# Altium project Remote_Emergency_Stop.PrjPcb
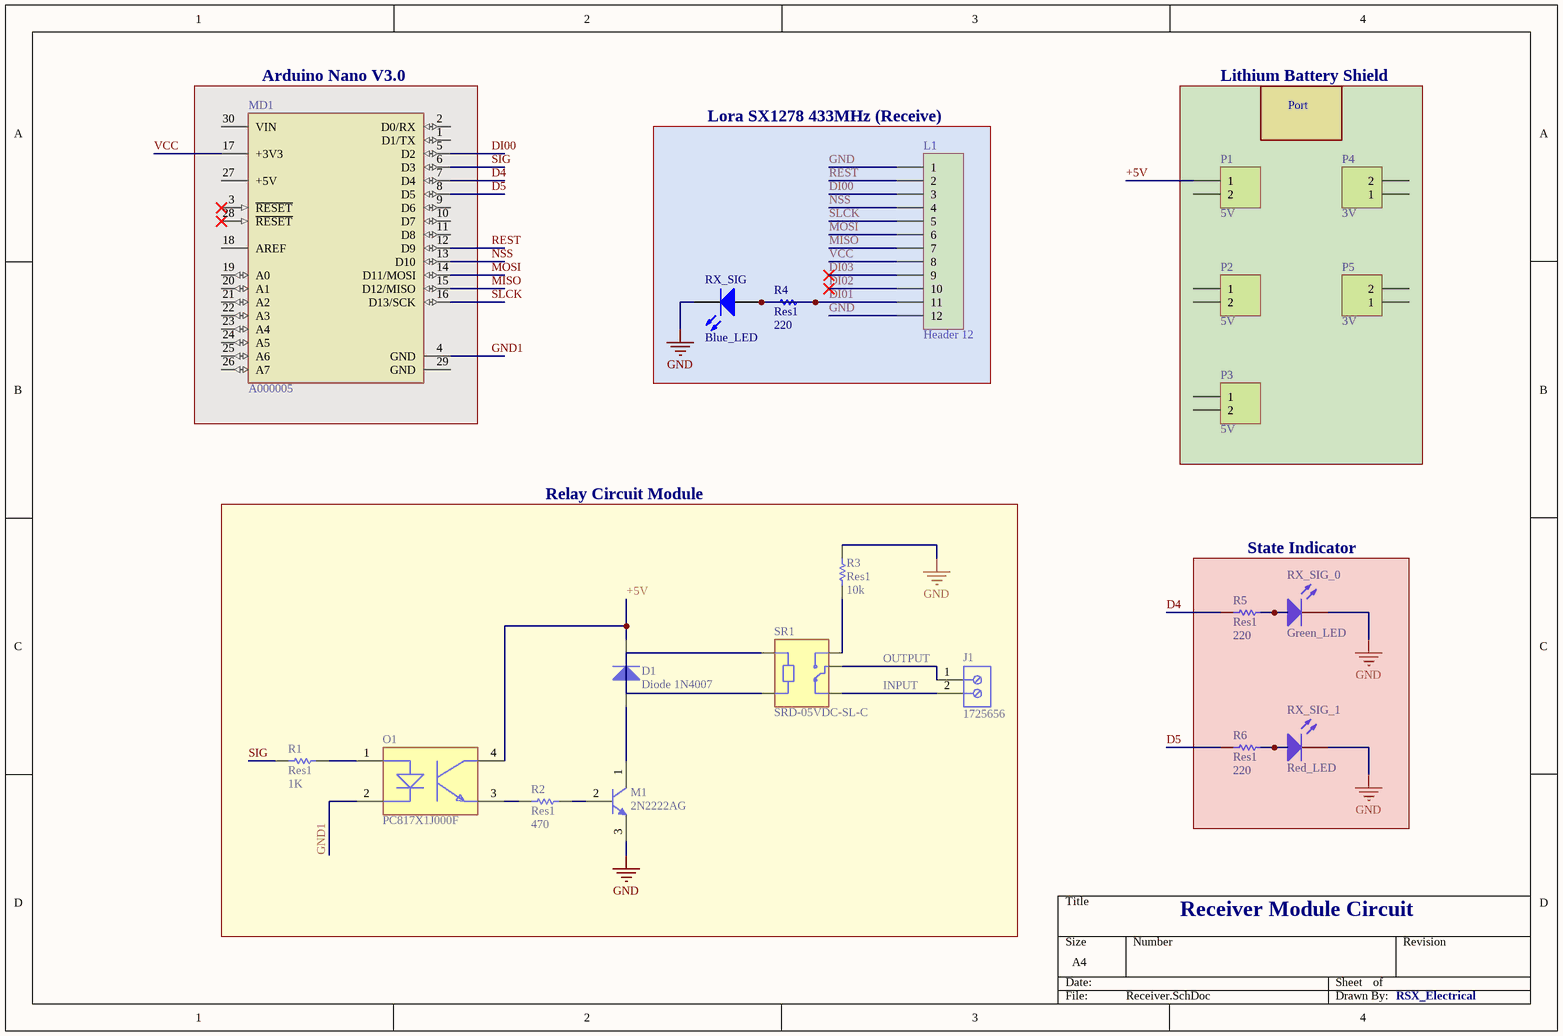
[diagram p0: Receiver.SchDoc]
2 sheets, 36 parts. Net scope: global (net labels, ports and power ports of the same name join across sheets).
Board file: Remote_E_Stop.PcbDoc
Sheets:
  Receiver.SchDoc
  Transmitter.SchDoc

## Sheet Receiver.SchDoc
size A4; SheetNumber: 1; SheetTotal: 1; SPICEModelCacheURACZJYY: <root> / <DocumentId>URACZJYY</DocumentId> / <CacheFrame Number="0"> / <Model Name="1n4007" Kind="MDL"> / <Text>*1N4007 MCE 8-16-95 / *1000V 1A Si GenPurpose Diode pkg:DIODE0.4 1,2 / .MODEL 1N4007 D(IS=2.55E-9 RS=0.042 N=1.75 TT=5.76E-6 CJO=1.85E-11 / + VJ=0.75 M=0.333 BV=1000 IBV=9.86E-5 )</Text> / </Model> / <Model Name="led0" Kind="MDL"> / <Text>*Typ INFRARED GaAs LED: Vf=1.2V Vr=5V If=40mA trr=3uS / *LED Pinout: 1=A, 2=K / .MODEL LED0 D (IS=93.5P RS=84M N=2.63 BV=5 IBV=10U / + CJO=2.97P VJ=.75 M=.333 TT=4.32U)</Text> / </Model> / </CacheFrame> / </root>

### Parts
D1  Diode 1N4007  [DO-41]
J1  1725656  [PHOE-1725656-2]
L1  Header 12  [HDR1X12]
M1  2N2222AG  [ONSC-TO-92-3-29-11]
MD1  A000005  [FP-A000005-MFG]
O1  PC817X1J000F  [FP-PC817X1J000F-MFG]
P1  5V  [HDR1X2]
P2  5V  [HDR1X2]
P3  5V  [HDR1X2]
P4  3V  [HDR1X2]
P5  3V  [HDR1X2]
R1  Res1  value 1K  [AXIAL-0.3]
R2  Res1  value 470  [AXIAL-0.3]
R3  Res1  value 10k  [AXIAL-0.3]
R4  Res1  value 220  [AXIAL-0.3]
R5  Res1  value 220  [AXIAL-0.3]
R6  Res1  value 220  [AXIAL-0.3]
RX_SIG  Blue_LED  [LED-0]
RX_SIG_0  Green_LED  [LED-0]
RX_SIG_1  Red_LED  [LED-0]
SR1  SRD-05VDC-SL-C  [RELAY_SRD-05VDC-SL-C]

### Blocks framed on the sheet
Arduino Nano V3.0: MD1
Lithium Battery Shield: P1-P5
Lora SX1278 433MHz (Receive): L1 R4 RX_SIG
Relay Circuit Module: D1 J1 M1 O1 R1-R3 SR1
State Indicator: R5 R6 RX_SIG_0 RX_SIG_1

### Nets
GND: L1.1 L1.12 M1.3(E) R3.2 RX_SIG.2(K) RX_SIG_0.2(K) RX_SIG_1.2(K)
+5V: D1.2(K) O1.4(C) P1.1
D4: MD1.7(D4) R5.2
D5: MD1.8(D5) R6.2
DI00: L1.3 MD1.5(D2)
DI01: L1.11 R4.1 R4.2 RX_SIG.1(A)
DI02: L1.10
DI03: L1.9
GND1: MD1.4(GND) O1.2(C)
MISO: L1.7 MD1.15(D12/MISO)
MOSI: L1.6 MD1.14(D11/MOSI)
NSS: L1.4 MD1.13(D10)
REST: L1.2 MD1.12(D9)
SIG: MD1.6(D3) R1.2
SLCK: L1.5 MD1.16(D13/SCK)
VCC: L1.8 MD1.17(+3V3)
NetD1_1: D1.1(A) M1.1(C)
NetJ1_1: J1.1 SR1.COM
NetJ1_2: J1.2 SR1.NC
NetM1_2: M1.2(B) R2.2
NetO1_1: O1.1(A) R1.1
NetO1_3: O1.3(E) R2.1
NetR3_1: R3.1 SR1.NO
NetR5_1: R5.1 RX_SIG_0.1(A)
NetR6_1: R6.1 RX_SIG_1.1(A)
NetSR1_A1: SR1.A1 SR1.A2

Not connected (* = marked no-connect by the designer): MD1 1(D1/TX) 2(D0/RX) 3(~{RESET})* 9(D6) 10(D7) 11(D8) 18(AREF) 19(A0) 20(A1) 21(A2) 22(A3) 23(A4) 24(A5) 25(A6) 26(A7) 27(+5V) 28(~{RESET})* 29(GND) 30(VIN); P1 2; P2 1 2; P3 1 2; P4 1 2; P5 1 2

### Notes on the sheet
- Port
- INPUT
- OUTPUT
- Receiver Module Circuit
- RSX_Electrical

### Library data of the parts
D1 = Diode 1N4007: 1 Amp General Purpose Rectifier; Published: 8-Jun-2000; LatestRevisionDate: 17-Jul-2002; LatestRevisionNote: Re-released for DXP Platform.; DatasheetVersion: 1998; PackageVersion: Aug-1999; PackageReference: DO-41; Publisher: Altium Limited; PackageDescription: Diode, Axial; Body 5.2 x 2.7 mm (LxDia. max), Lead Dia. 0.86 mm (max); Code_JEDEC: DO-204-AL; ComponentLink1Description: Manufacturer Link; ComponentLink1URL: http://www.fairchildsemi.com/; ComponentLink2Description: Datasheet; ComponentLink2URL: http://www.fairchildsemi.com/ds/1N%2F1N4001.pdf
J1 = CMP-2000-05299-1: Male Header, Pitch 2.54 mm, 1 x 2 Position, Height 9 mm, Tail Length 3.5 mm; Manufacturer: Phoenix Contact; Number of contacts: 2; Content: 250pc(s); Pitch: 2.54mm; Industrial packaging: Yes; Colour: Green; Manufacturer part No.: 1725656; Type: MPT0,5/2-2,54; Datasheet URL: http://datasheet.octopart.com/1725656-Phoenix-Contact-datasheet-5302866.pdf; Manufacturer URL: http://www.phoenixcontact.com/; Datasheet Version: Apr-08
L1 = Header 12: Header, 12-Pin; LatestRevisionDate: 17-Jul-2002; LatestRevisionNote: Re-released for DXP Platform.; Publisher: Altium Limited
M1 = CMP-1048-01402-1: Amplifier Transistor, NPN Silicon, 3-Pin TO-92, Pb-Free, Bulk Box; PartNumber: P2N2222AG; Manufacturer: On Semiconductor; IC Continuous (A): 0.6; fT Min (MHz): 300; ComponentLink2Description: Datasheet; ComponentLink1Description: Manufacturer URL; ComponentLink2URL: http://www.onsemi.com/pub_link/Collateral/P2N2222A-D.PDF; ComponentLink3Description: Package Specification; RoHS: TRUE; ComponentLink1URL: http://www.onsemi.com/; Mounting Technology: Through Hole; PackageReference: TO-92-3-29-11_AM_SL; Polarity: NPN; Packing: Bulk Box; DatasheetVersion: Rev. 7; PackageDescription: 3-Pin Transistor Outline, Body 4.825 x 3.685 mm, Pitch 1.27 mm; PackageVersion: Rev. AM; ComponentLink3URL: http://www.onsemi.cn/pub_link/Collateral/2N6426-D.PDF
MD1 = CMP-189986-000002-1: ARDUINO NANO ATMEGA328 EVAL BRD; Number of Bits: 8; Evaluation Kit: Yes; Operating Supply Voltage: 12V; Interface: I2C; Data Bus Width: 8b; Core Architecture: AVR; Packaging: Bulk; Length: 7inch; Package Quantity: 50; Width: 5inch; REACH SVHC: No SVHC; Weight: 0.358383oz; Series: AVR® ATmega; Height: 0.25inch
O1 = CMP-65434-000003-1: OPTOISOLATOR 5KV TRANS 4DIP; Collector Emitter Saturation Voltage: 200mV; Forward Voltage: 1.4V; Power Dissipation: 200mW; Input Current: 20mA; Max Collector Current: 50mA; Collector Emitter Breakdown Voltage: 80V; Rise Time: 18000ns; Number of Elements: 1; Reverse Breakdown Voltage: 6V; Current Transfer Ratio: 600%; Min Operating Temperature: -30°C; Number of Pins: 4; Radiation Hardening: No; Output Current per Channel: 50mA; Case/Package: DIP; Fall Time: 18000ns; Forward Current: 50mA; Isolation Voltage: 5kV; Package Quantity: 2000; Max Operating Temperature: 100°C; Packaging: Sleeve; Max Input Current: 50mA; Output Voltage: 80V; Max Power Dissipation: 200mW; Mount: Through Hole; Number of Channels: 1; Collector Emitter Voltage (VCEO): 80V
P1-P5 = Header 2: Header, 2-Pin; LatestRevisionDate: 17-Jul-2002; LatestRevisionNote: Re-released for DXP Platform.; Publisher: Altium Limited
R1-R6 = Res1: Resistor; Published: 8-Jun-2000; LatestRevisionDate: 17-Jul-2002; LatestRevisionNote: Re-released for DXP Platform.; PackageReference: AXIAL-0.3; Publisher: Altium Limited; PackageDescription: Axial Device, Thru-Hole; 2 Leads; 0.3 in Pin Spacing
RX_SIG RX_SIG_0 RX_SIG_1 = LED0: Typical INFRARED GaAs LED; Published: 8-Jun-2000; LatestRevisionDate: 08-Jul-2005; LatestRevisionNote: Mech Layer 1 removed.; PackageReference: LED-0; Publisher: Altium Limited; PackageDescription: LED; 2 Leads
SR1 = SRD-05VDC-SL-C: 5V Trigger Relay Module For Arduino And Raspberry Pi 5V Trigger Relay Module For Arduino And Raspberry Pi; MF: Songle Relay; Value: *; Price: None; Package: NON STANDARD-5 Songle Relay; Availability: Not in stock; Check_prices: https://www.snapeda.com/parts/SRD-05VDC-SL-C/Songle+Relay/view-part/?ref=eda; MP: SRD-05VDC-SL-C; SnapEDA_Link: https://www.snapeda.com/parts/SRD-05VDC-SL-C/Songle+Relay/view-part/?ref=snap

## Sheet Transmitter.SchDoc
size A4; SheetNumber: 2; SheetTotal: 2; SPICEModelCacheDROQVVJG: <root> / <DocumentId>DROQVVJG</DocumentId> / <CacheFrame Number="0"> / <Model Name="led0" Kind="MDL"> / <Text>*Typ INFRARED GaAs LED: Vf=1.2V Vr=5V If=40mA trr=3uS / *LED Pinout: 1=A, 2=K / .MODEL LED0 D (IS=93.5P RS=84M N=2.63 BV=5 IBV=10U / + CJO=2.97P VJ=.75 M=.333 TT=4.32U)</Text> / </Model> / </CacheFrame> / </root>
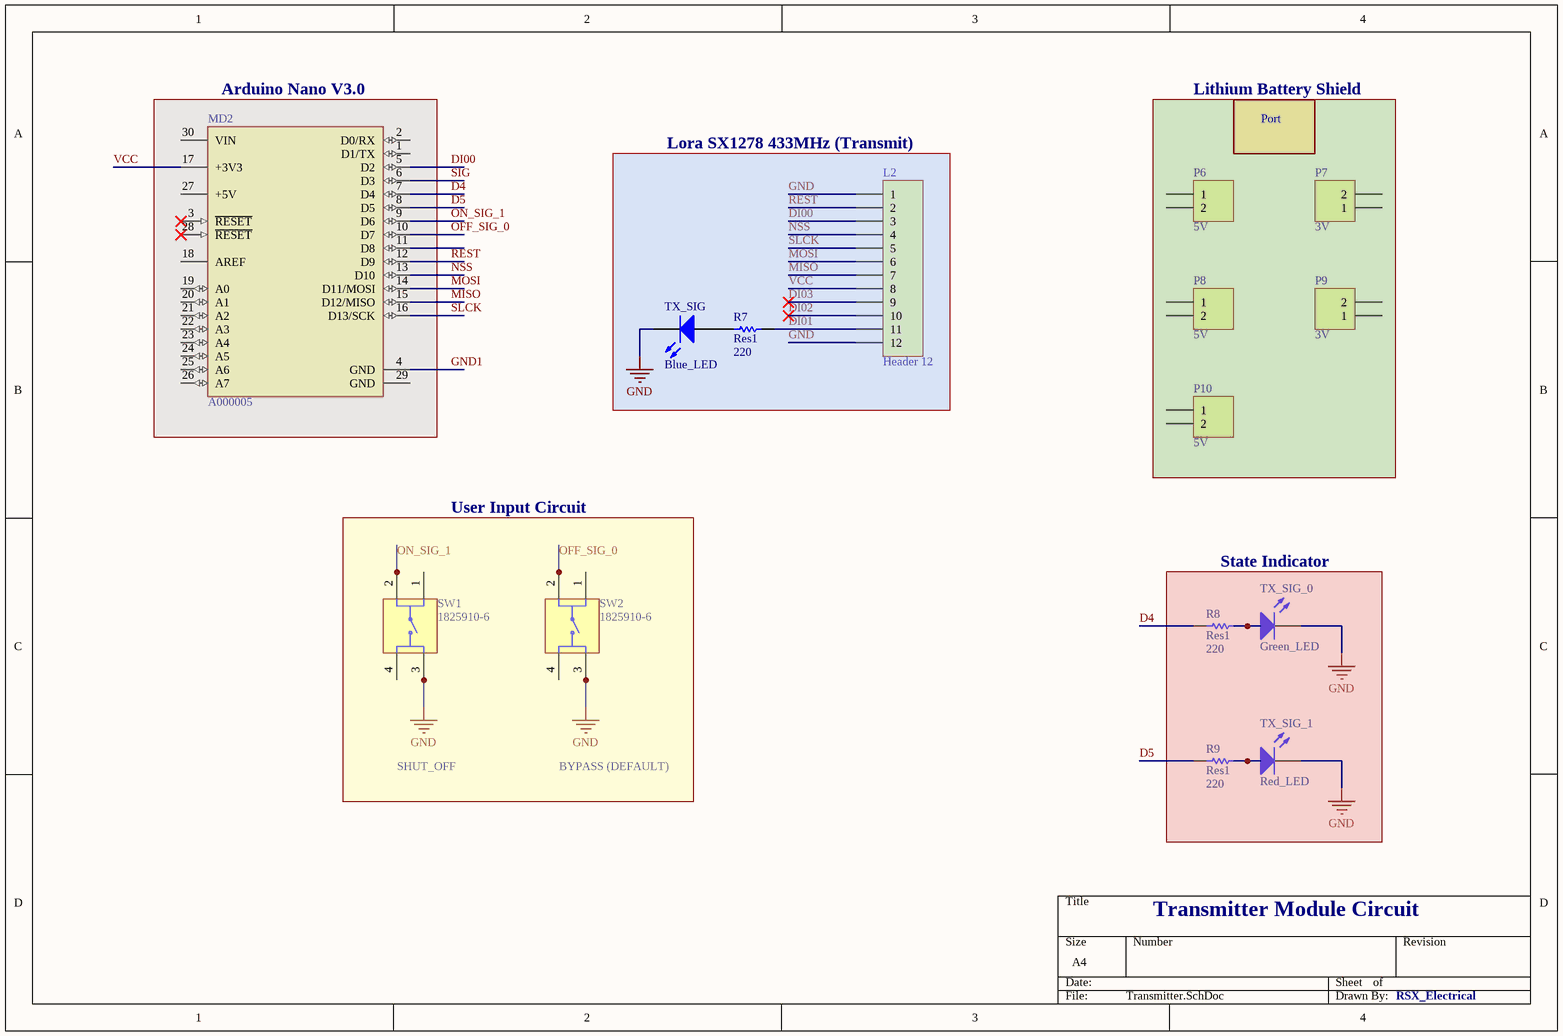
[diagram p1: Transmitter.SchDoc]

### Parts
L2  Header 12  [HDR1X12]
MD2  A000005  [FP-A000005-MFG]
P6  5V  [HDR1X2]
P7  3V  [HDR1X2]
P8  5V  [HDR1X2]
P9  3V  [HDR1X2]
P10  5V  [HDR1X2]
R7  Res1  value 220  [AXIAL-0.3]
R8  Res1  value 220  [AXIAL-0.3]
R9  Res1  value 220  [AXIAL-0.3]
SW1  1825910-6  [SW_1825910-6-4]
SW2  1825910-6  [SW_1825910-6-4]
TX_SIG  Blue_LED  [LED-0]
TX_SIG_0  Green_LED  [LED-0]
TX_SIG_1  Red_LED  [LED-0]

### Blocks framed on the sheet
Arduino Nano V3.0: MD2
Lithium Battery Shield: P6-P10
Lora SX1278 433MHz (Transmit): L2 R7 TX_SIG
User Input Circuit: SW1 SW2
State Indicator: R8 R9 TX_SIG_0 TX_SIG_1

### Nets
GND: L2.1 L2.12 SW1.3 SW2.3 TX_SIG.2(K) TX_SIG_0.2(K) TX_SIG_1.2(K)
D4: MD2.7(D4) R8.2
D5: MD2.8(D5) R9.2
DI00: L2.3 MD2.5(D2)
DI01: L2.11 R7.1
DI02: L2.10
DI03: L2.9
GND1: MD2.4(GND)
MISO: L2.7 MD2.15(D12/MISO)
MOSI: L2.6 MD2.14(D11/MOSI)
NSS: L2.4 MD2.13(D10)
OFF_SIG_0: MD2.10(D7) SW2.2
ON_SIG_1: MD2.9(D6) SW1.2
REST: L2.2 MD2.12(D9)
SIG: MD2.6(D3)
SLCK: L2.5 MD2.16(D13/SCK)
VCC: L2.8 MD2.17(+3V3)
NetR7_2: R7.2 TX_SIG.1(A)
NetR8_1: R8.1 TX_SIG_0.1(A)
NetR9_1: R9.1 TX_SIG_1.1(A)

Not connected (* = marked no-connect by the designer): MD2 1(D1/TX) 2(D0/RX) 3(~{RESET})* 11(D8) 18(AREF) 19(A0) 20(A1) 21(A2) 22(A3) 23(A4) 24(A5) 25(A6) 26(A7) 27(+5V) 28(~{RESET})* 29(GND) 30(VIN); P6 1 2; P7 1 2; P8 1 2; P9 1 2; P10 1 2; SW1 1 4; SW2 1 4

### Notes on the sheet
- Port
- SHUT_OFF
- BYPASS (DEFAULT)
- Transmitter Module Circuit
- RSX_Electrical

### Library data of the parts
L2 = Header 12: Header, 12-Pin; LatestRevisionDate: 17-Jul-2002; LatestRevisionNote: Re-released for DXP Platform.; Publisher: Altium Limited
MD2 = CMP-189986-000002-1: as MD1 on sheet Receiver; Packaging: Bulk; Length: 7inch; Package Quantity: 50; Width: 5inch; REACH SVHC: No SVHC; Weight: 0.358383oz; Series: AVR® ATmega; Height: 0.25inch
P6-P10 = Header 2: Header, 2-Pin; LatestRevisionDate: 17-Jul-2002; LatestRevisionNote: Re-released for DXP Platform.; Publisher: Altium Limited
R7-R9 = Res1: Resistor; Published: 8-Jun-2000; LatestRevisionDate: 17-Jul-2002; LatestRevisionNote: Re-released for DXP Platform.; PackageReference: AXIAL-0.3; Publisher: Altium Limited; PackageDescription: Axial Device, Thru-Hole; 2 Leads; 0.3 in Pin Spacing
SW1 SW2 = 1825910-6: Switch Tactile OFF (ON) SPST Round Button PC Pins 0.05A 24VDC 100000Cycles 1.57N Thru-Hole Loose; Package: None; MP: 1825910-6; Value: *; Price: None; Availability: Unavailable
TX_SIG TX_SIG_0 TX_SIG_1 = LED0: Typical INFRARED GaAs LED; Published: 8-Jun-2000; LatestRevisionDate: 08-Jul-2005; LatestRevisionNote: Mech Layer 1 removed.; PackageReference: LED-0; Publisher: Altium Limited; PackageDescription: LED; 2 Leads

## Nets that join several sheets
GND: Receiver (7 pins), Transmitter (7 pins)
D4: Receiver (MD1.7 R5.2), Transmitter (MD2.7 R8.2)
D5: Receiver (MD1.8 R6.2), Transmitter (MD2.8 R9.2)
DI00: Receiver (L1.3 MD1.5), Transmitter (L2.3 MD2.5)
DI01: Receiver (L1.11 R4.1 R4.2 RX_SIG.1), Transmitter (L2.11 R7.1)
DI02: Receiver (L1.10), Transmitter (L2.10)
DI03: Receiver (L1.9), Transmitter (L2.9)
GND1: Receiver (MD1.4 O1.2), Transmitter (MD2.4)
MISO: Receiver (L1.7 MD1.15), Transmitter (L2.7 MD2.15)
MOSI: Receiver (L1.6 MD1.14), Transmitter (L2.6 MD2.14)
NSS: Receiver (L1.4 MD1.13), Transmitter (L2.4 MD2.13)
REST: Receiver (L1.2 MD1.12), Transmitter (L2.2 MD2.12)
SIG: Receiver (MD1.6 R1.2), Transmitter (MD2.6)
SLCK: Receiver (L1.5 MD1.16), Transmitter (L2.5 MD2.16)
VCC: Receiver (L1.8 MD1.17), Transmitter (L2.8 MD2.17)